# EAGLE design main (EAGLE 7.4.0)
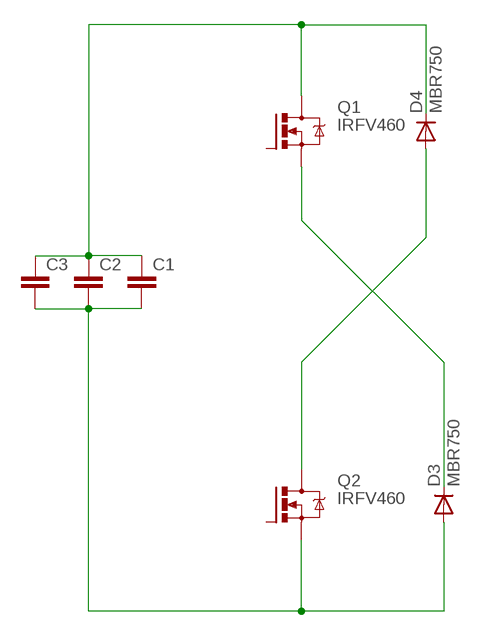
[diagram p0: schematic, sheet 1]

## Parts
C1  C-EU375-203X418  [C375-203X418]
C2  C-EU375-203X418  [C375-203X418]
C3  C-EU375-203X418  [C375-203X418]
D3  MBR750  [TO220AC]
D4  MBR750  [TO220AC]
Q1  IRFV460  [TO258AA]
Q2  IRFV460  [TO258AA]

## Nets
N$1: D3.C Q1.2-S(S)
N$2: D4.A Q2.1-D(D)
N$3: C1.2 C2.2 C3.2 D3.A Q2.2-S(S)
N$4: C1.1 C2.1 C3.1 D4.C Q1.1-D(D)
Unconnected: Q1.3-G(G) Q2.3-G(G)

## Library data of the parts
C1-C3 = rcl:C-EU: CAPACITOR, European symbol
D3 D4 = diode:MBR750: DIODE barrier rectifier, 7.5 A, 50 V
Q1 Q2 = transistor-power:IRFV460: HEXFET N-Channel Transistor

## Board
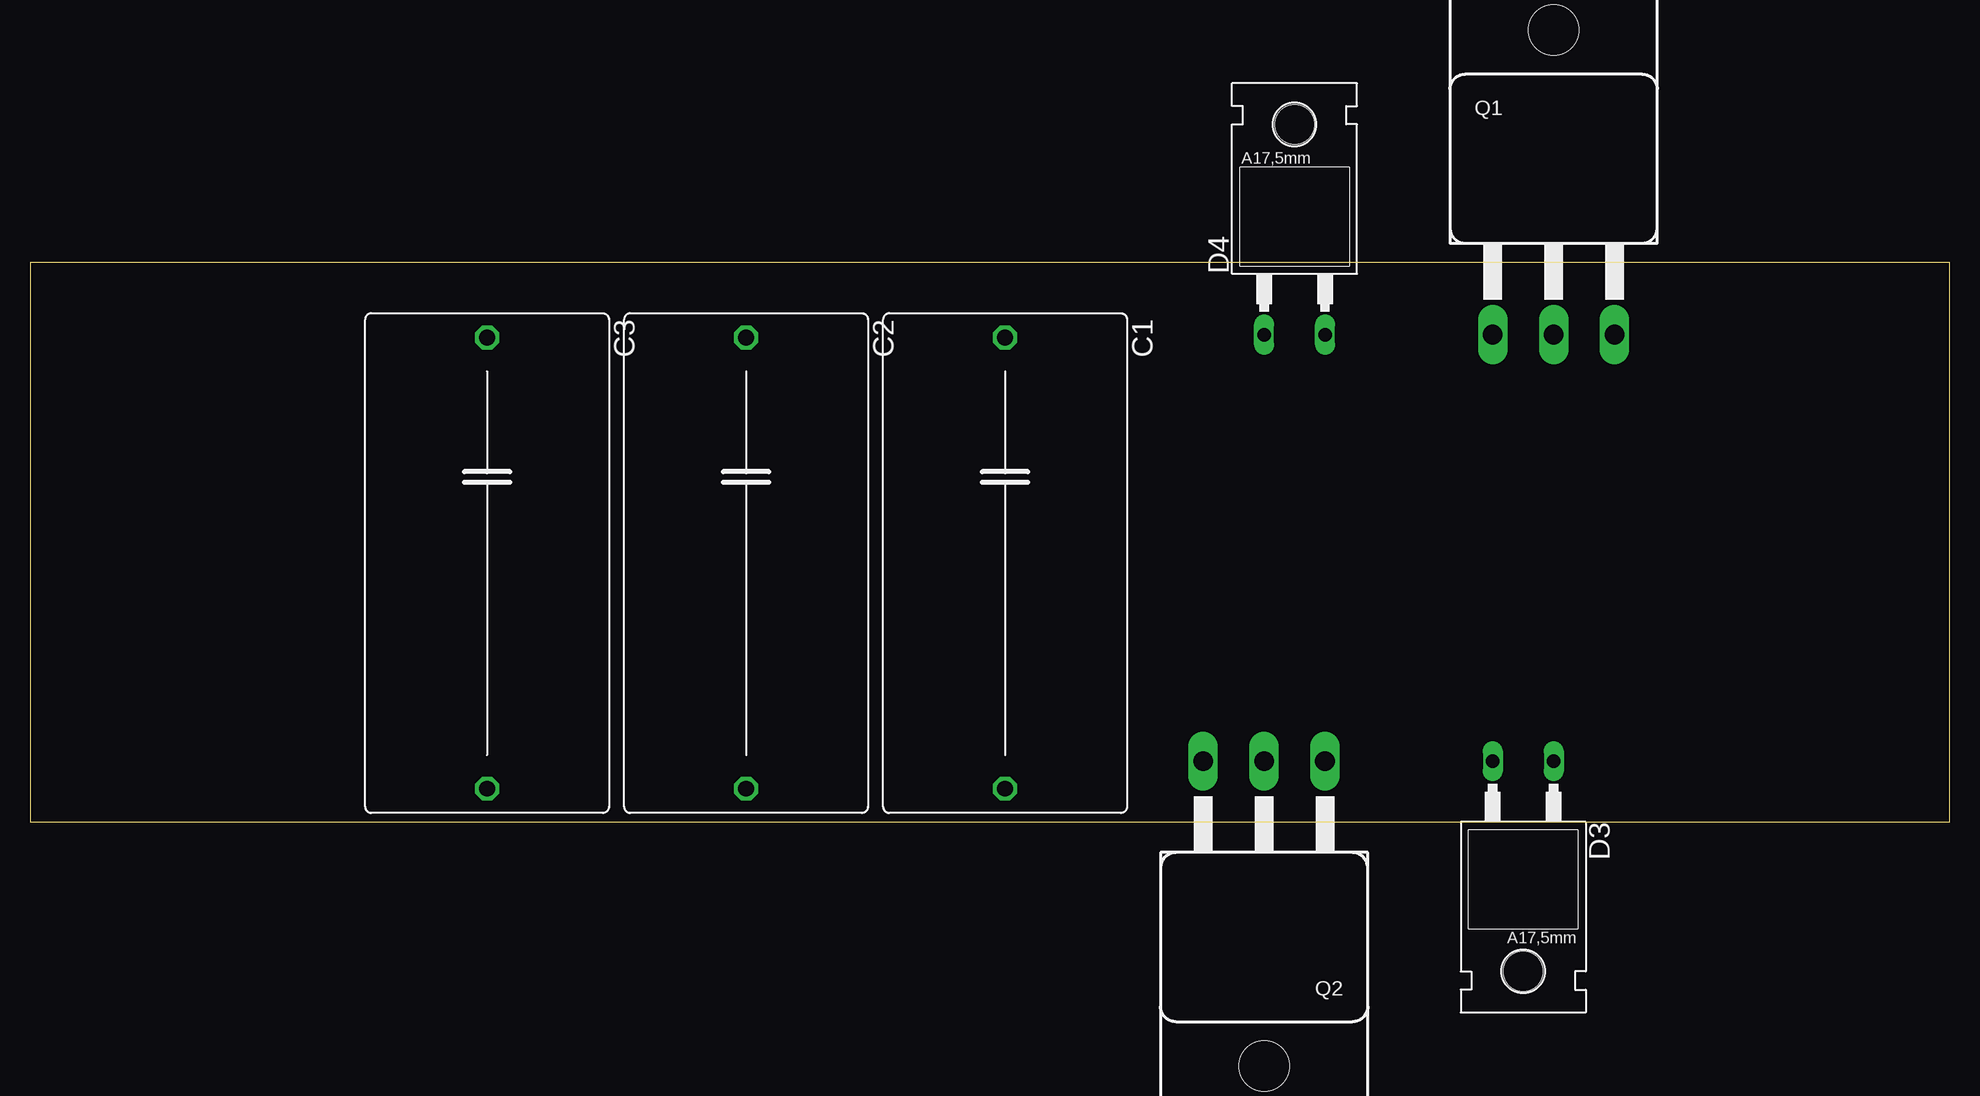
[diagram p1: board, top side]
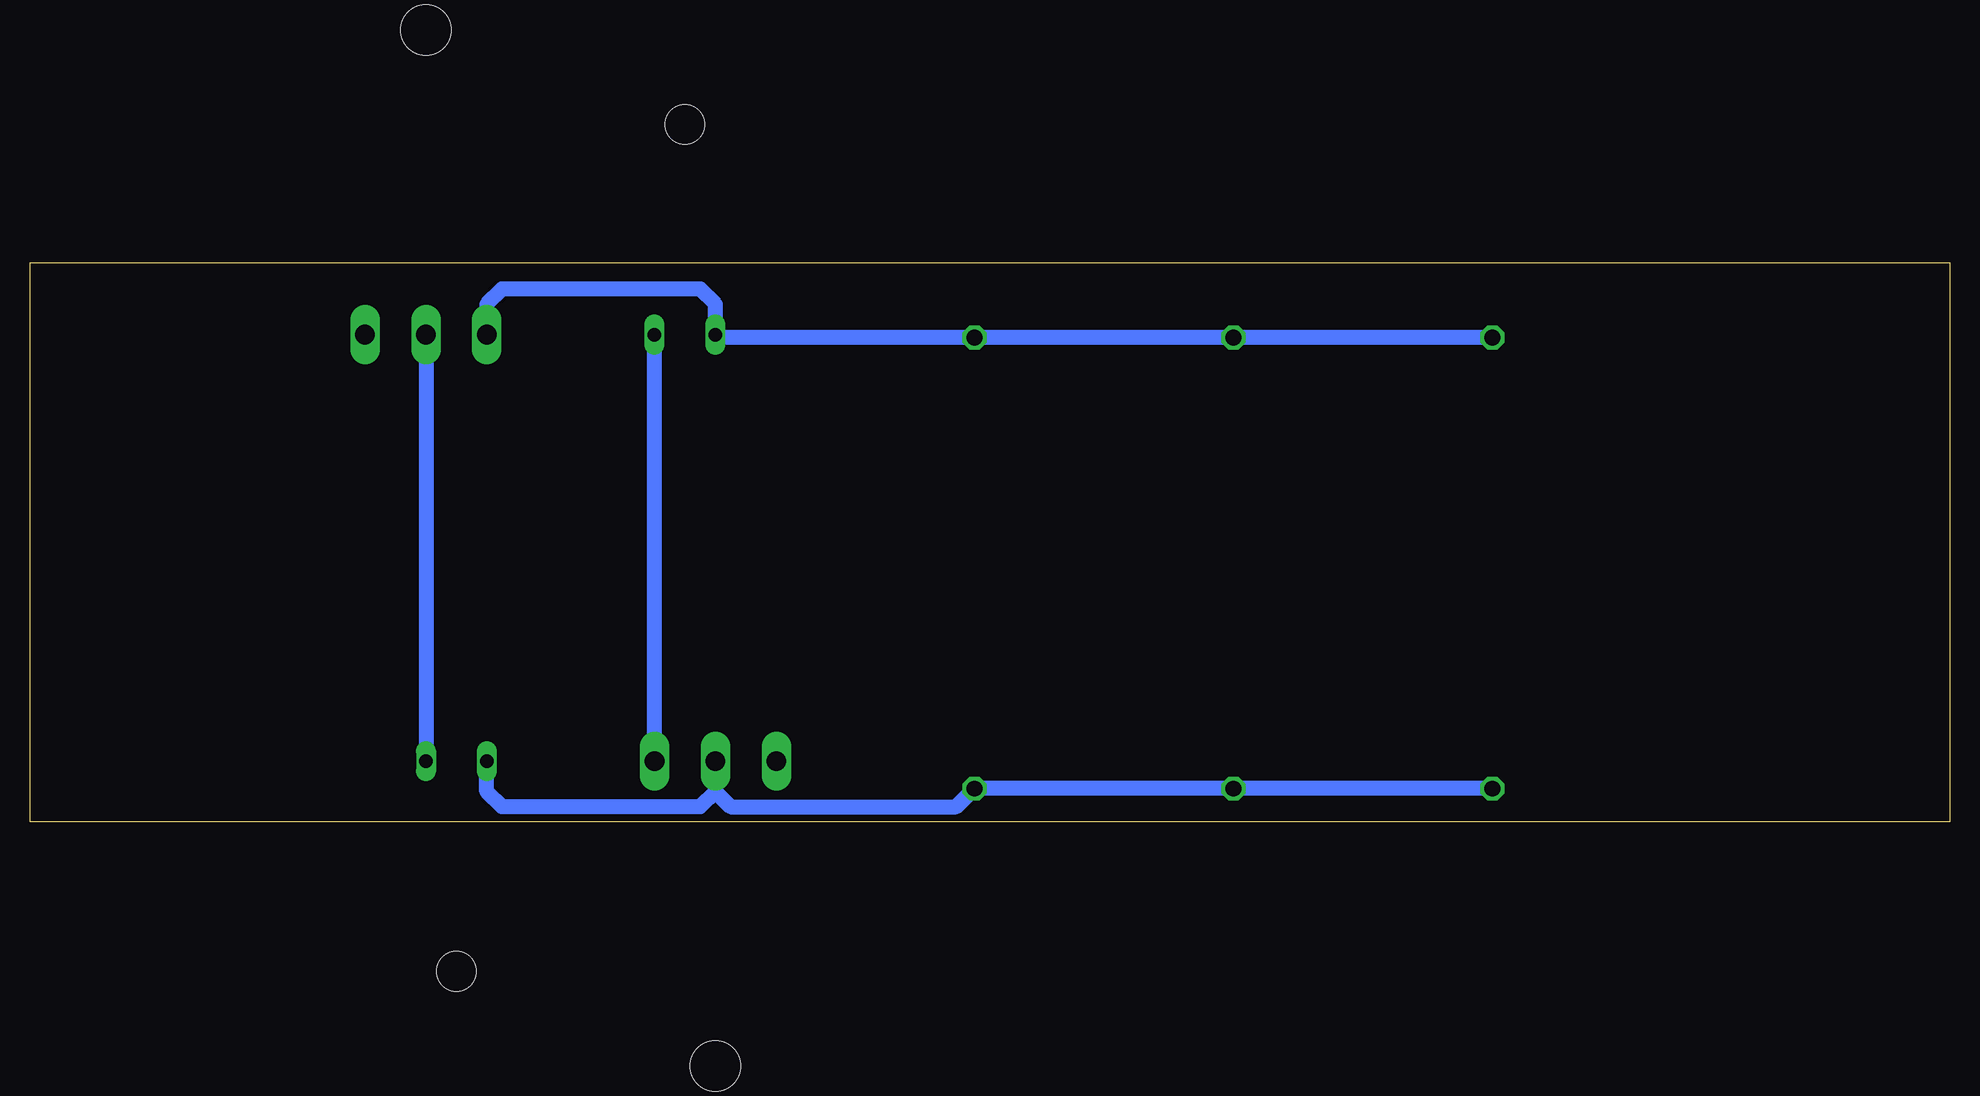
[diagram p2: board, bottom side, seen from below]

Size 160 x 46.66 mm. Coordinates in mm from the lower left corner, seen from the top.
Outline: 0,0 160,0 160,46.66 0,46.66 0,0
Copper layers (1*16): Top 0.035mm / dielectric 1.5mm / Bottom 0.035mm
Design rules "default": minimum track width 10mil, minimum drill 24mil, track to track 8mil, track to pad 8mil, pad to pad 8mil, via to via 8mil, smd to smd 8mil, copper to edge 40mil, drill to drill 8mil, minimum pad ring 10mil, minimum via ring 8mil, stop-mask expansion 4mil, vias tented up to drill 0mil, thermal gap 10mil

### Footprints (pad centres in the part's own frame; a part is rotated, then mirrored left to right if it is on the bottom)
C375-203X418 = drill 1.321 octagon: 1 -18.796,0; 2 18.796,0
TO220AC = drill 1.118 long: A 2.54,-6.35; C -2.54,-6.35 | hole 3.302: 0,11.176
TO258AA = drill 1.651 long: 1-D -5.08,-25.4; 2-S 0,-25.4; 3-G 5.08,-25.4 | hole 4.191: 0,0

### Placement (x,y rotation side)
C1  81.28,21.59 270 top
C2  59.69,21.59 270 top
C3  38.1,21.59 270 top
D3  124.46,-1.27 180 top
D4  105.41,46.99 0 top
Q1  127,66.04 0 top
Q2  102.87,-20.32 180 top

### Tracks (layer width: path | path; a pad name or v marks a point on that pad's centre or on a via)
N$1
  Bottom 1.27: Q1.2-S D3.C
N$2
  Bottom 1.27: Q2.1-D D4.A
N$3
  Bottom 1.27: Q2.2-S 102.87,2.54 | 102.87,2.54 104.14,1.27 120.65,1.27 121.92,2.54 D3.A | 102.87,2.54 101.6,1.27 82.8,1.27 C1.2 C2.2 C3.2
N$4
  Bottom 1.27: Q1.1-D 121.92,43.18 120.65,44.45 104.14,44.45 102.87,43.18 D4.C 102.62,40.39 C1.1 C2.1 C3.1